# Altium project Sensor_Current.PrjPcb
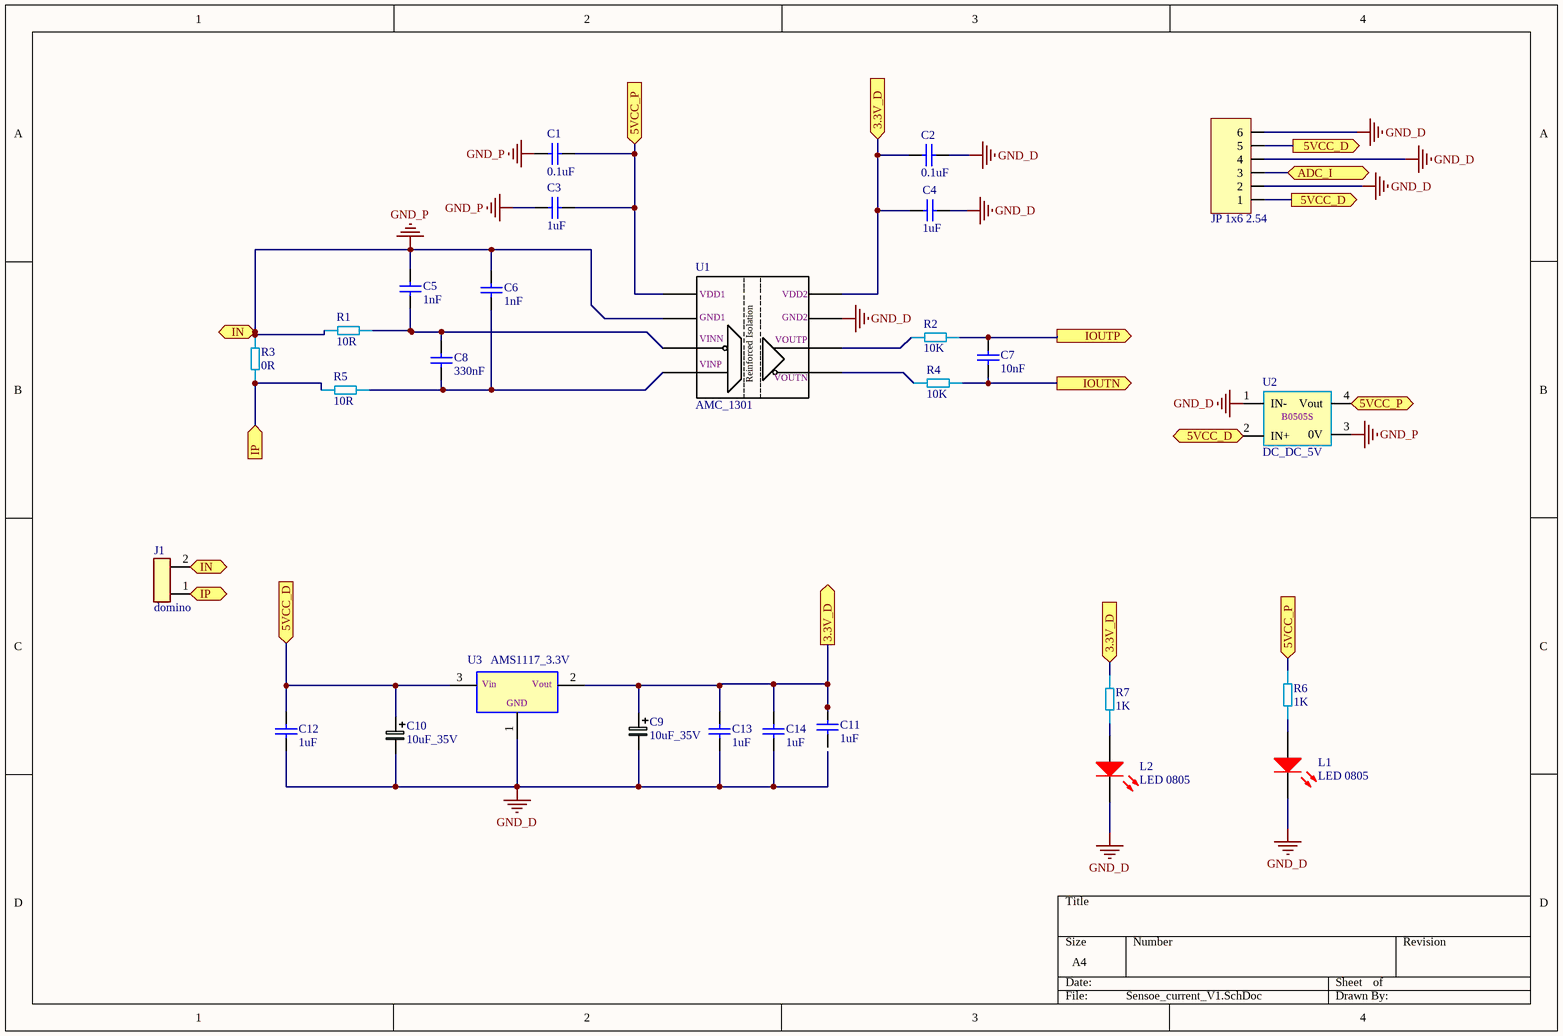
[diagram p0: Sensoe_current_V1.SchDoc]
1 sheet, 28 parts. Net scope: flat (ports and power ports of the same name join across sheets).
Board file: Sensor_current_V1.PcbDoc

## Sheet Sensoe_current_V1.SchDoc
size A4

### Parts
C1  0.1uF  [Tu 0805_N]
C2  0.1uF  [Tu 0805_N]
C3  1uF  [Tu 0805_N]
C4  1uF  [Tu 0805_N]
C5  1nF  [Tu 0805_N]
C6  1nF  [Tu 0805_N]
C7  10nF  [Tu 0805_N]
C8  330nF  [Tu 0805_N]
C9  10uF_35V  [tu_4x5.4mm]
C10  10uF_35V  [tu_4x5.4mm]
C11  1uF  [Tu 0805_N]
C12  1uF  [Tu 0805_N]
C13  1uF  [Tu 0805_N]
C14  1uF  [Tu 0805_N]
J1  domino  [domino_2pin_5.08mm]
JP1  JP 1x6 2.54  [JP 1X6 DT]
L1  LED 0805  [LED-0805-Red]
L2  LED 0805  [LED-0805-Red]
R1  10R  [RES1206]
R2  10K  [RES1206]
R3  0R  [RES_2512]
R4  10K  [RES1206]
R5  10R  [RES1206]
R6  1K  [RES1206]
R7  1K  [RES1206]
U1  AMC_1301  [SOIC_8_SO8W]
U2  DC_DC_5V  [B0512S/D-1W]
U3  AMS1117_3.3V  [TO-252]

### Ports
3.3V_D (in), 3.3V_D (out), 5VCC_D (in), 5VCC_D (out), 5VCC_P (in), 5VCC_P (out), ADC_I, IN (in), IN (out), IOUTN (out), IOUTP (out), IP (in), IP (out)

### Nets
GND_D: C2.2 C4.1 C9.2 C10.2 C12.1 C13.1 C14.1 JP1.2 JP1.4 JP1.6 L1.2(K) L2.2(K) U1.5(GND2) U2.1(IN-) U3.1(GND)
GND_P: C1.1 C3.2 C5.1 C6.1 J1.2 R1.1 R3.2 U1.4(GND1) U2.3(0V) ; port IN
NetC1_2: C1.2 C3.1 R6.2 U1.1(VDD1) U2.4(Vout) ; port 5VCC_P
NetC2_1: C2.1 C4.2 C9.1 C11.2 C13.2 C14.2 R7.2 U1.8(VDD2) U3.2(Vout) ; port 3.3V_D
NetC5_2: C5.2 C8.1 R1.2 U1.3(VINN)
NetC6_2: C6.2 C8.2 R5.2 U1.2(VINP)
NetC7_1: C7.1 R4.2 ; port IOUTN
NetC7_2: C7.2 R2.2 ; port IOUTP
NetC10_1: C10.1 C12.2 JP1.1 JP1.5 U2.2(IN+) U3.3(Vin) ; port 5VCC_D
NetJ1_1: J1.1 R3.1 R5.1 ; port IP
NetJP1_3: JP1.3 ; port ADC_I
NetL1_1: L1.1(A) R6.1
NetL2_1: L2.1(A) R7.1
NetR2_1: R2.1 U1.7(VOUTP)
NetR4_1: R4.1 U1.6(VOUTN)

Not connected (* = marked no-connect by the designer): C11 1

### Notes on the sheet
- (in symbol AMC_1301) Reinforced Isolation
- (in symbol DC_DC_5v) B0505S

### Library data of the parts
C1-C8 C11-C14 = cap_0805
C9 C10 = capacitor_electric
JP1 = JP 1x6 2.54 Duc Thang: Cắm; Ten_Linh_Kien: Jump Đơn Đực 2.54MM 1x40P Thẳng 11MM; Don_Vi: Con; Ma_Hang: MH000903; Ghi_Chu: *; Kieu_Chan: *; Chung_Loai: Cắm
L1 L2 = LED 0805 Do: Dán; Don_Vi: Con; Ma_Hang: MH000897; Ten_Linh_Kien: LED 0805 Màu Đỏ (Red); Ghi_Chu: *; Kieu_Chan: *; Chung_Loai: Dán
R1-R7 = 311-0.0GRTR-ND
U3 = AMS1117CD